# EAGLE design TESTOMATIC-v1_0 (EAGLE 9.7.0)

## Sheet 1 of 3: Power
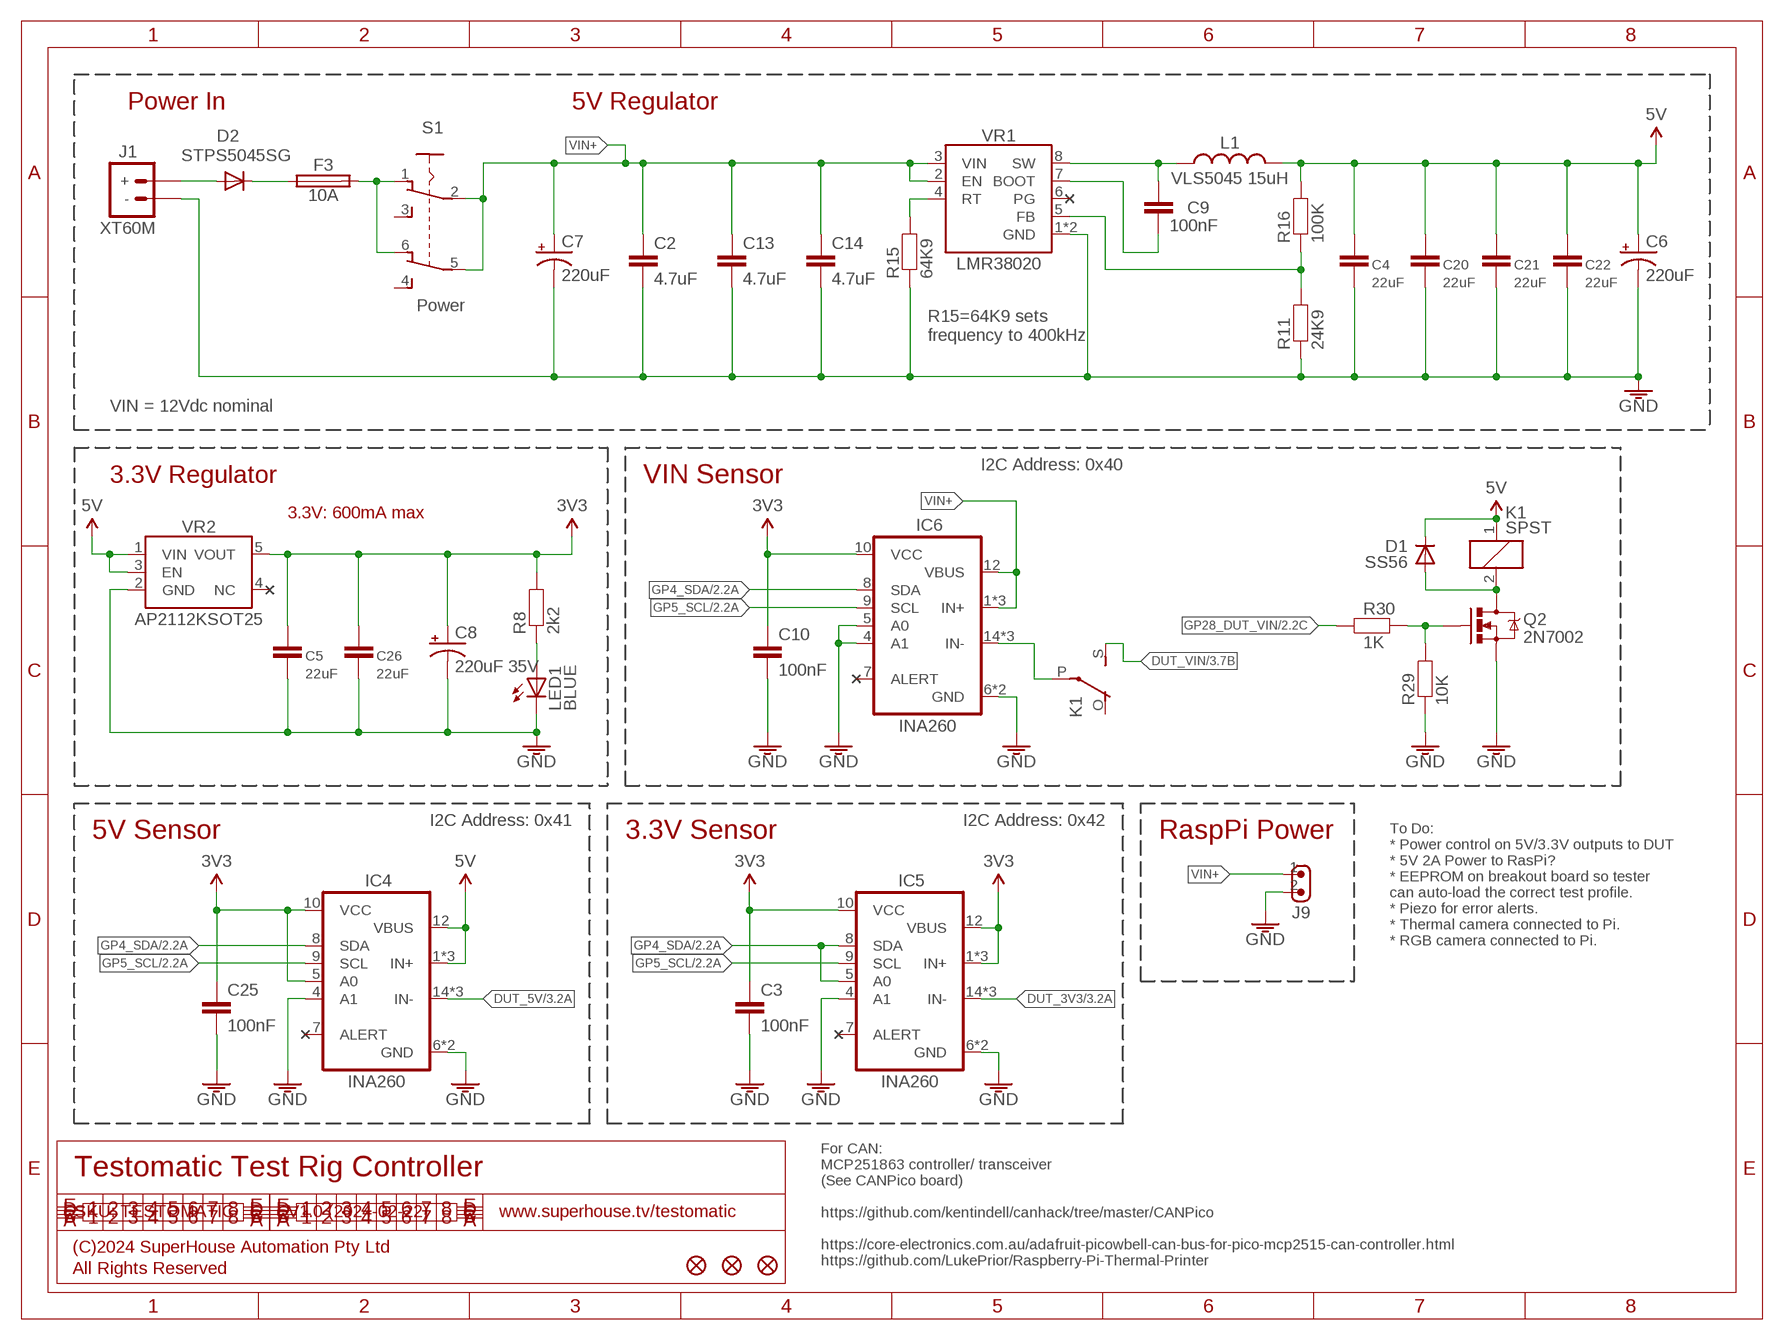
[diagram p0: schematic, sheet 1]

### Parts
C2  4.7uF  CAP1206  [C1206]
C3  100nF  CAP0603  [C0603]
C4  22uF  CAP0805  [C0805]
C5  22uF  CAP0805  [C0805]
C6  220uF  CAP_POLG  [PANASONIC_G]
C7  220uF  CAP_POLG  [PANASONIC_G]
C8  220uF 35V  CAP_POLG  [PANASONIC_G]
C9  100nF  CAP0603  [C0603]
C10  100nF  CAP0603  [C0603]
C13  4.7uF  CAP1206  [C1206]
C14  4.7uF  CAP1206  [C1206]
C20  22uF  CAP0805  [C0805]
C21  22uF  CAP0805  [C0805]
C22  22uF  CAP0805  [C0805]
C25  100nF  CAP0603  [C0603]
C26  22uF  CAP0805  [C0805]
D1  SS56  DIODESMA  [SMA-DIODE]
D2  STPS5045SG  DIODE-D2PAK  [D2PACK]
F3  10A  FUSE-MCCQ  [MCCQ-122]
FID1  FIDUCIAL1X2.5  [FIDUCIAL-1X2.5]
FID2  FIDUCIAL1X2.5  [FIDUCIAL-1X2.5]
FID3  FIDUCIAL1X2.5  [FIDUCIAL-1X2.5]
IC4  INA260  [TSSOP-16]
IC5  INA260  [TSSOP-16]
IC6  INA260  [TSSOP-16]
J1  XT60M  XTXX-60M  [XT60PW-M]
J9  M02-SCREW-3.81MM-VERT  [SCREWTERMINAL-3.81MM-VERT-2]
K1  SPST  [G5LE]
L1  VLS5045 15uH  INDUCTOR-5045  [INDUCTOR-5045]
LED1  BLUE  LED0603  [LED-0603]
Q2  2N7002  MOSFET-NCHANNEL-233  [SOT23-3]
R8  2k2  RESISTOR0603  [R0603]
R11  24K9  RESISTOR0603  [R0603]
R15  64K9  RESISTOR0603  [R0603]
R16  100K  RESISTOR0603  [R0603]
R29  10K  RESISTOR0603  [R0603]
R30  1K  RESISTOR0603  [R0603]
S1  Power  SWITCH-DPDT3  [7201SD9AV2BE]
VR1  LMR38020  LMR38010  [HSOIC8]
VR2  AP2112KSOT25  [SOT23-5]

### Nets
3.3V: C3.1 C5.1 C8.+ C10.1 C25.1 C26.1 IC4.5(A0) IC4.10(VCC) IC5.1(IN+) IC5.2(IN+) IC5.3(IN+) IC5.10(VCC) IC5.12(VBUS) IC6.10(VCC) R8.2 VR2.5(VOUT) ; also sheet 2,3
5V: C4.1 C6.+ C20.1 C21.1 C22.1 D1.C IC4.1(IN+) IC4.2(IN+) IC4.3(IN+) IC4.12(VBUS) K1.1 L1.2 R16.2 VR2.1(VIN) VR2.3(EN) ; also sheet 3
DUT_3V3: IC5.14(IN-) IC5.15(IN-) IC5.16(IN-) ; also sheet 3
DUT_5V: IC4.14(IN-) IC4.15(IN-) IC4.16(IN-) ; also sheet 3
DUT_VIN: K1.S(2:NO) ; also sheet 3
GND: C2.2 C3.2 C4.2 C5.2 C6.- C7.- C8.- C10.2 C13.2 C14.2 C20.2 C21.2 C22.2 C25.2 C26.2 IC4.4(A1) IC4.6(GND) IC4.11(GND) IC5.4(A1) IC5.6(GND) IC5.11(GND) IC6.4(A1) IC6.5(A0) IC6.6(GND) IC6.11(GND) J1.- J9.2 LED1.C Q2.2(S) R11.1 R15.1 R29.1 VR1.1(GND) VR1.TGND(GND) VR2.2(GND) ; also sheet 2,3
GP4_SDA: IC4.8(SDA) IC5.5(A0) IC5.8(SDA) IC6.8(SDA) ; also sheet 2,3
GP5_SCL: IC4.9(SCL) IC5.9(SCL) IC6.9(SCL) ; also sheet 2,3
GP28_DUT_VIN: R30.1 ; also sheet 2
N$3: C9.1 L1.1 VR1.8(SW)
N$8: D2.2(C) F3.1 F3.2
N$13: R15.2 VR1.4(RT)
N$16: IC6.14(IN-) IC6.15(IN-) IC6.16(IN-) K1.P(2:COM)
N$17: D1.A K1.2 Q2.3(D)
N$18: R11.2 R16.1 VR1.5(FB)
N$19: C9.2 VR1.7(BOOT)
N$23: LED1.A R8.1
N$24: Q2.1(G) R29.2 R30.2
N$25: F3.3 F3.4 S1.1 S1.6
N$26: D2.1(A) D2.3(A) J1.+
VIN+: C2.1 C7.+ C13.1 C14.1 IC6.1(IN+) IC6.2(IN+) IC6.3(IN+) IC6.12(VBUS) J9.1 S1.2 S1.5 VR1.2(EN) VR1.3(VIN)
Unconnected: IC4.7(ALERT) IC5.7(ALERT) IC6.7(ALERT) K1.O(2:NC) S1.3 S1.4 VR2.4(NC)

### Notes on the sheet
- Power In | 5V Regulator
- R15=64K9 sets
  frequency to 400kHz
- VIN = 12Vdc nominal
- I2C Address: 0x40
- 3.3V Regulator | VIN Sensor
- 3.3V: 600mA max
- I2C Address: 0x41 | I2C Address: 0x42
- 5V Sensor | 3.3V Sensor | RaspPi Power
- To Do:
  * Power control on 5V/3.3V outputs to DUT
  * 5V 2A Power to RasPi?
  * EEPROM on breakout board so tester
  can auto-load the correct test profile.
  * Piezo for error alerts.
  * Thermal camera connected to Pi.
  * RGB camera connected to Pi.
- Testomatic Test Rig Controller
- SKU: TESTOMATIC | V1.0 (2024-02-22) | www.superhouse.tv/testomatic
- (C)2024 SuperHouse Automation Pty Ltd
- For CAN:
  MCP251863 controller/ transceiver
  (See CANPico board)
  
  https://github.com/kentindell/canhack/tree/master/CANPico
  
  https://core-electronics.com.au/adafruit-picowbell-can-bus-for-pico-mcp2515-can-controller.html
  https://github.com/LukePrior/Raspberry-Pi-Thermal-Printer
- All Rights Reserved

## Sheet 2 of 3: Microcontroller
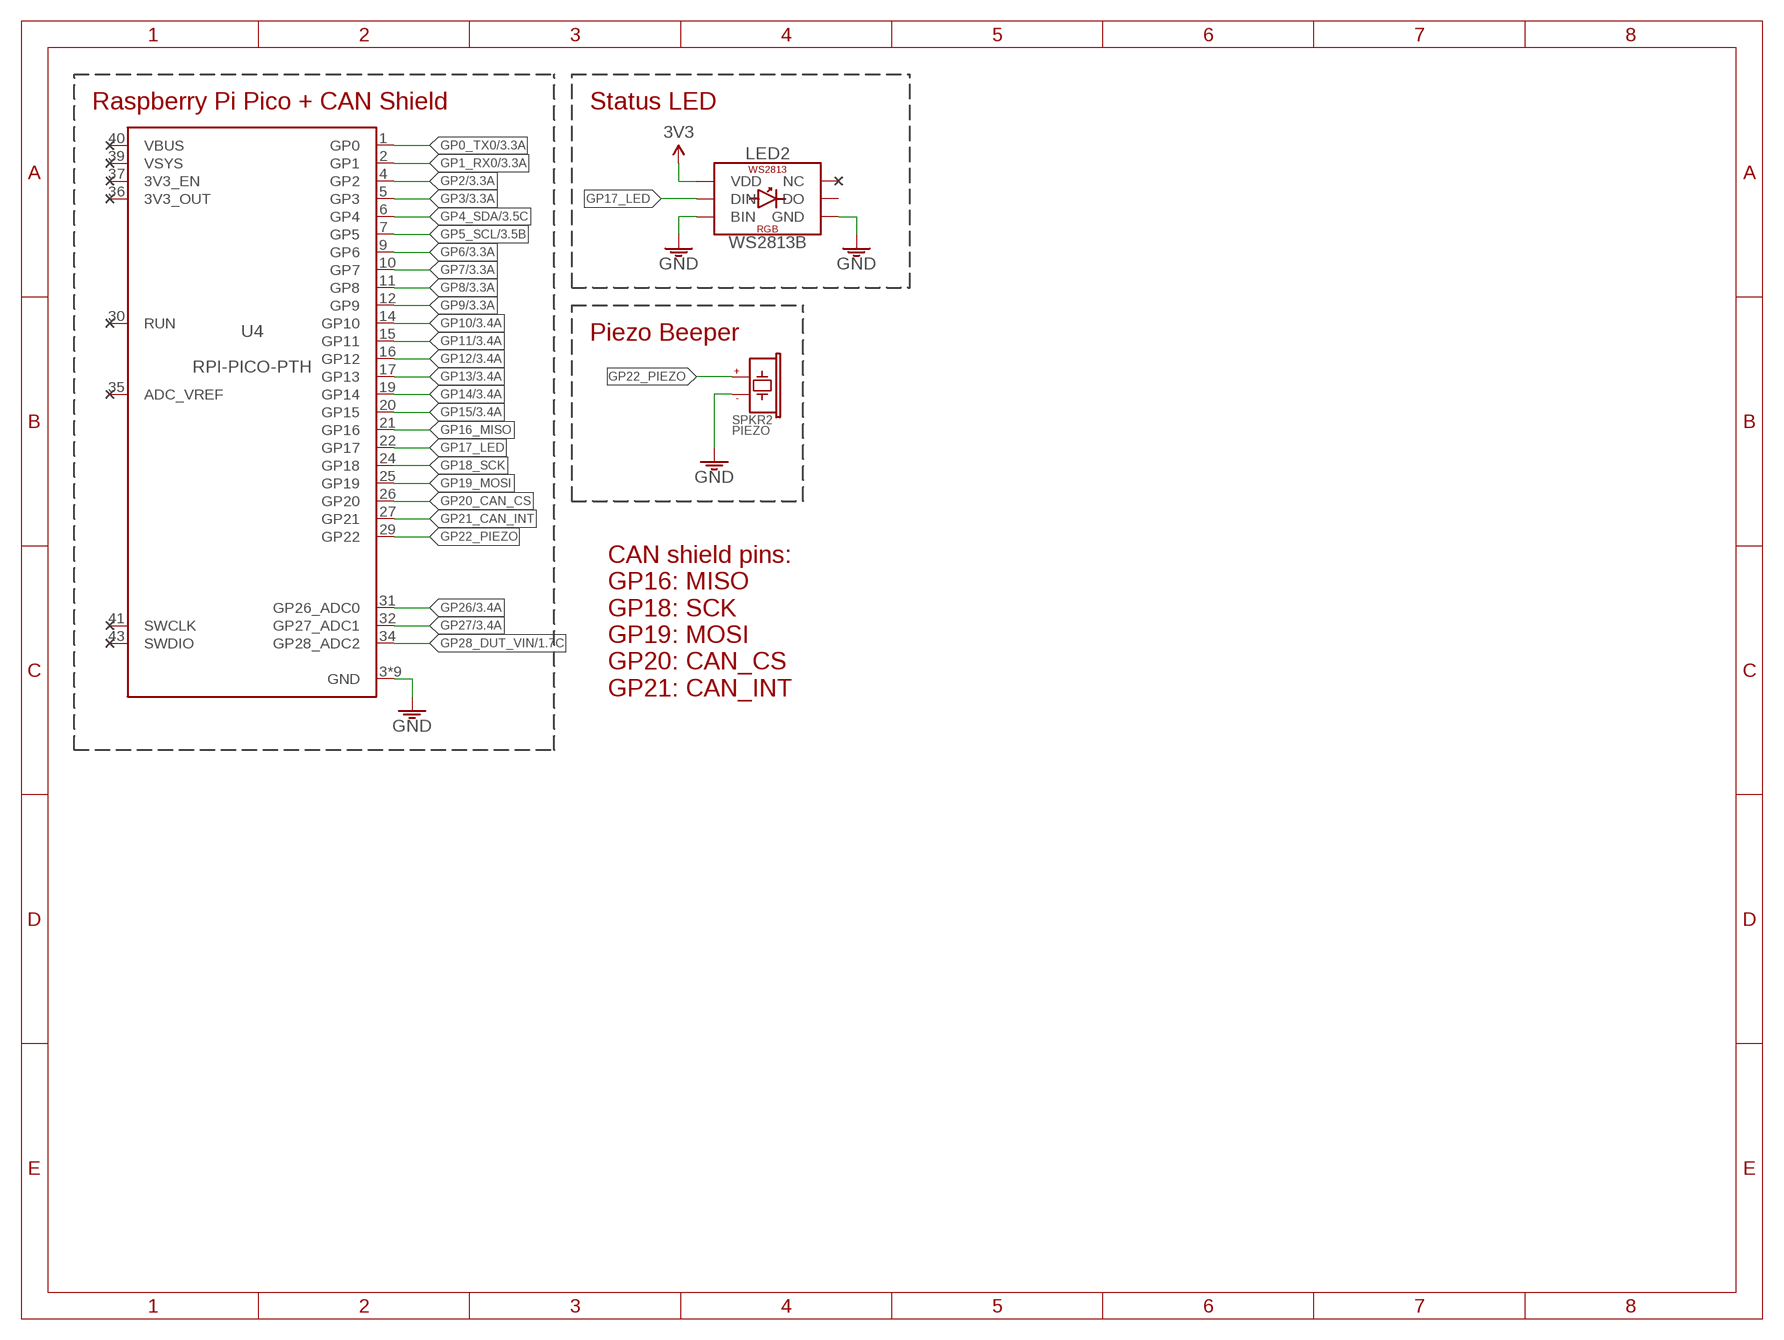
[diagram p1: schematic, sheet 2]

### Parts
LED2  WS2813B  WS2813-5050  [WS2813]
SPKR2  PIEZO  PIEZOPOLARISED-SMT  [PIEZO-9.6X9.6-SMT]
U4  RPI-PICO-PTH  [PICO-PTH]

### Nets
3.3V: LED2.2(VDD) ; also sheet 1,3
GND: LED2.5(GND) LED2.6(BIN) SPKR2.2(-) U4.3(GND) U4.8(GND) U4.13(GND) U4.18(GND) U4.23(GND) U4.28(GND) U4.33(GND) U4.38(GND) U4.42(GND) ; also sheet 1,3
GP0_TX0: U4.1(GP0) ; also sheet 3
GP1_RX0: U4.2(GP1) ; also sheet 3
GP2: U4.4(GP2) ; also sheet 3
GP3: U4.5(GP3) ; also sheet 3
GP4_SDA: U4.6(GP4) ; also sheet 1,3
GP5_SCL: U4.7(GP5) ; also sheet 1,3
GP6: U4.9(GP6) ; also sheet 3
GP7: U4.10(GP7) ; also sheet 3
GP8: U4.11(GP8) ; also sheet 3
GP9: U4.12(GP9) ; also sheet 3
GP10: U4.14(GP10) ; also sheet 3
GP11: U4.15(GP11) ; also sheet 3
GP12: U4.16(GP12) ; also sheet 3
GP13: U4.17(GP13) ; also sheet 3
GP14: U4.19(GP14) ; also sheet 3
GP15: U4.20(GP15) ; also sheet 3
GP16_MISO: U4.21(GP16)
GP17_LED: LED2.4(DIN) U4.22(GP17)
GP18_SCK: U4.24(GP18)
GP19_MOSI: U4.25(GP19)
GP20_CAN_CS: U4.26(GP20)
GP21_CAN_INT: U4.27(GP21)
GP22_PIEZO: SPKR2.1(+) U4.29(GP22)
GP26: U4.31(GP26_ADC0) ; also sheet 3
GP27: U4.32(GP27_ADC1) ; also sheet 3
GP28_DUT_VIN: U4.34(GP28_ADC2) ; also sheet 1
Unconnected: LED2.1(NC) LED2.3(DO) U4.30(RUN) U4.35(ADC_VREF) U4.36(3V3_OUT) U4.37(3V3_EN) U4.39(VSYS) U4.41(SWCLK) U4.43(SWDIO)

### Notes on the sheet
- Raspberry Pi Pico + CAN Shield | Status LED
- Piezo Beeper
- CAN shield pins:
  GP16: MISO
  GP18: SCK
  GP19: MOSI
  GP20: CAN_CS
  GP21: CAN_INT

## Sheet 3 of 3: Headers
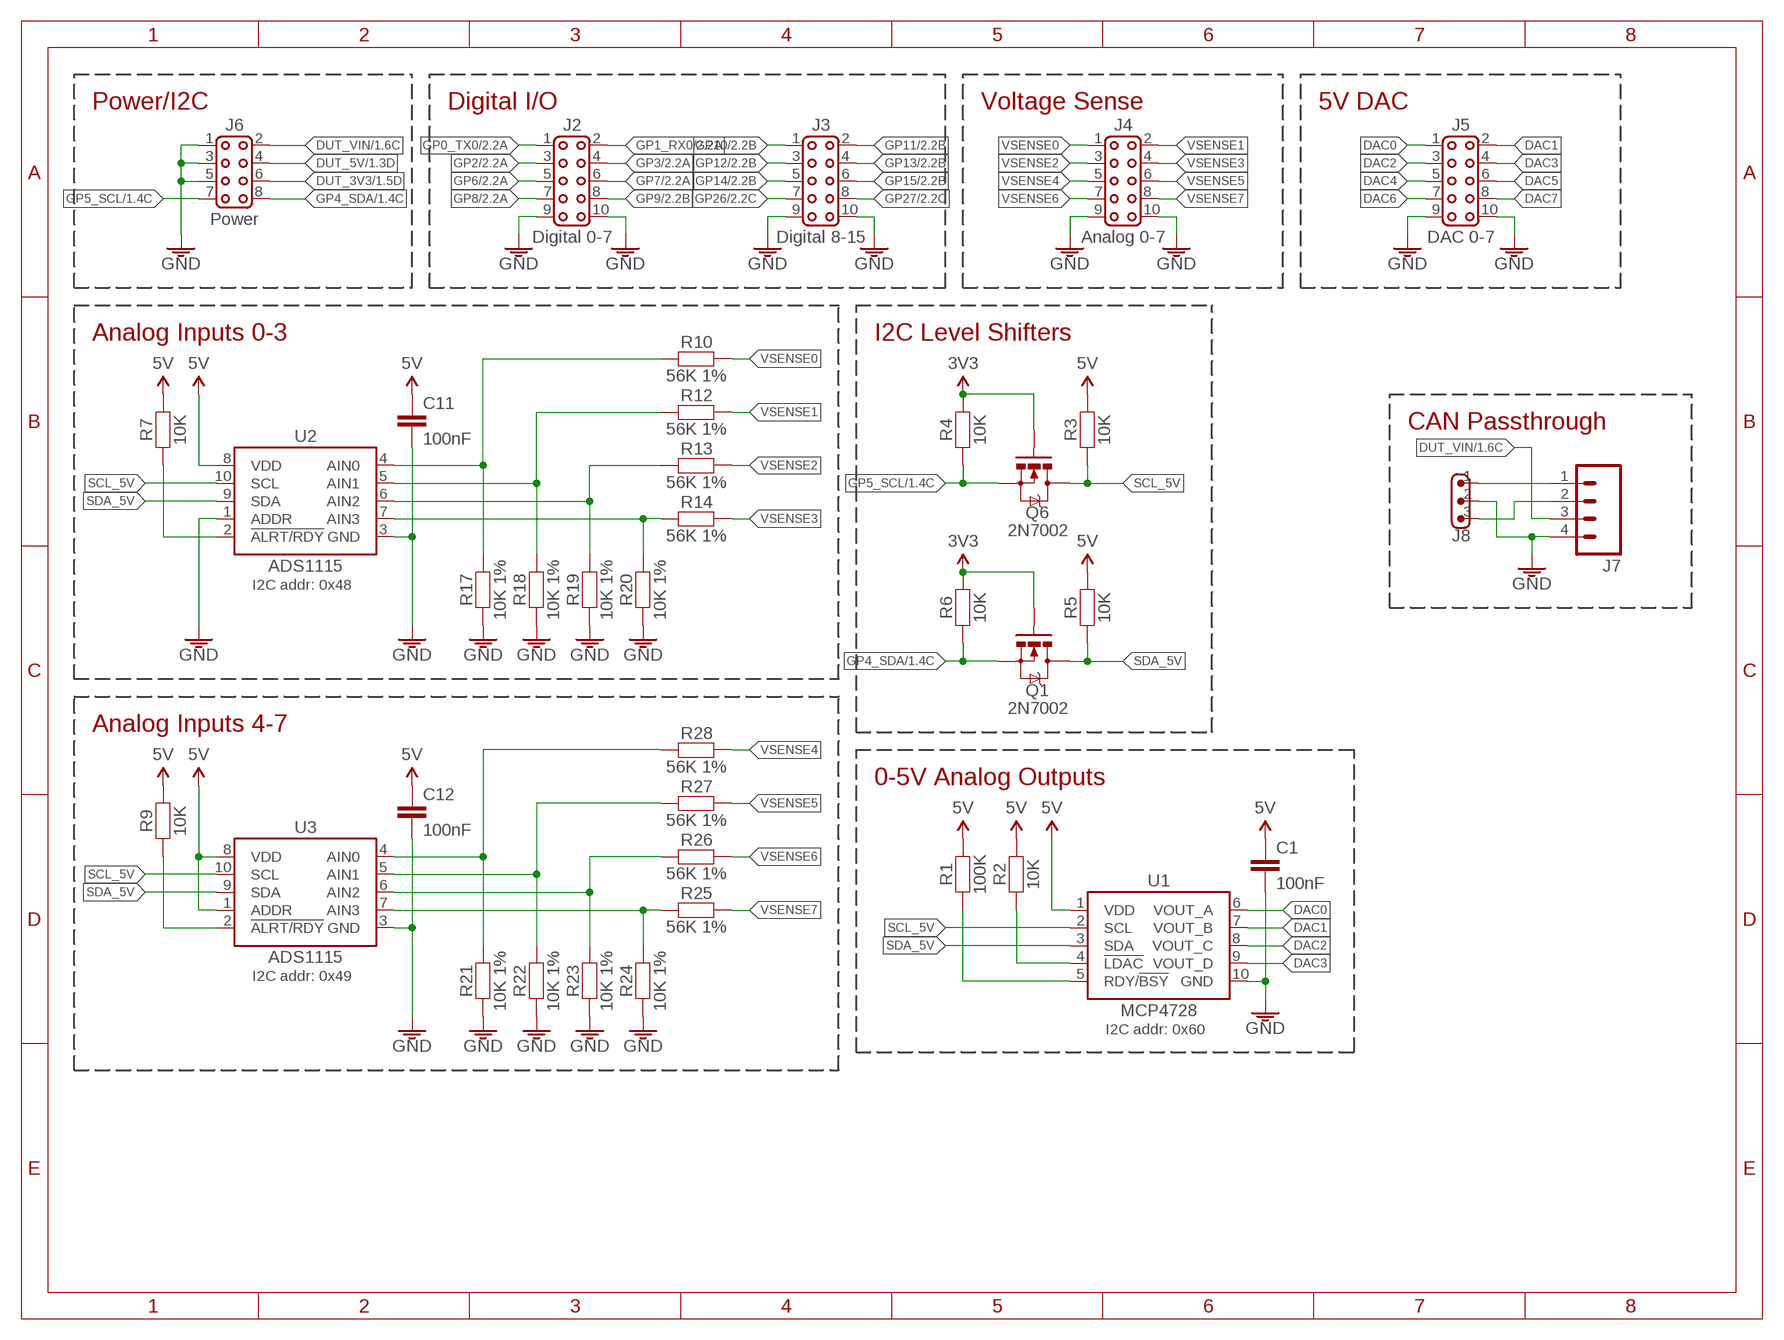
[diagram p2: schematic, sheet 3]

### Parts
C1  100nF  CAP0603  [C0603]
C11  100nF  CAP0603  [C0603]
C12  100nF  CAP0603  [C0603]
J2  Digital 0-7  M02X5-SHROUDED  [2X05-2.54-SHROUDED]
J3  Digital 8-15  M02X5-SHROUDED  [2X05-2.54-SHROUDED]
J4  Analog 0-7  M02X5-SHROUDED  [2X05-2.54-SHROUDED]
J5  DAC 0-7  M02X5-SHROUDED  [2X05-2.54-SHROUDED]
J6  Power  M02X4-SHROUD  [2X04-2.54-SHROUDED]
J7  M04-SCREW-3.81MM-VERT-PLUG  [SCREWTERMINAL-3.81MM-VERT-4]
J8  M03-SCREW-3.5MM  [SCREWTERMINAL-3.5MM-3]
Q1  2N7002  MOSFET-NCHANNEL-233  [SOT23-3]
Q6  2N7002  MOSFET-NCHANNEL-233  [SOT23-3]
R1  100K  RESISTOR0603  [R0603]
R2  10K  RESISTOR0603  [R0603]
R3  10K  RESISTOR0603  [R0603]
R4  10K  RESISTOR0603  [R0603]
R5  10K  RESISTOR0603  [R0603]
R6  10K  RESISTOR0603  [R0603]
R7  10K  RESISTOR0603  [R0603]
R9  10K  RESISTOR0603  [R0603]
R10  56K 1%  RESISTOR0603  [R0603]
R12  56K 1%  RESISTOR0603  [R0603]
R13  56K 1%  RESISTOR0603  [R0603]
R14  56K 1%  RESISTOR0603  [R0603]
R17  10K 1%  RESISTOR0603  [R0603]
R18  10K 1%  RESISTOR0603  [R0603]
R19  10K 1%  RESISTOR0603  [R0603]
R20  10K 1%  RESISTOR0603  [R0603]
R21  10K 1%  RESISTOR0603  [R0603]
R22  10K 1%  RESISTOR0603  [R0603]
R23  10K 1%  RESISTOR0603  [R0603]
R24  10K 1%  RESISTOR0603  [R0603]
R25  56K 1%  RESISTOR0603  [R0603]
R26  56K 1%  RESISTOR0603  [R0603]
R27  56K 1%  RESISTOR0603  [R0603]
R28  56K 1%  RESISTOR0603  [R0603]
U1  MCP4728  [MSOP10]
U2  ADS1115  [MSOP10]
U3  ADS1115  [MSOP10]

### Nets
3.3V: Q1.1(G) Q6.1(G) R4.2 R6.2 ; also sheet 1,2
5V: C1.1 C11.1 C12.1 R1.2 R2.2 R3.2 R5.2 R7.2 R9.2 U1.1(VDD) U2.8(VDD) U3.1(ADDR) U3.8(VDD) ; also sheet 1
DAC0: J5.1 U1.6(VOUT_A)
DAC1: J5.2 U1.7(VOUT_B)
DAC2: J5.3 U1.8(VOUT_C)
DAC3: J5.4 U1.9(VOUT_D)
DAC4: J5.5
DAC5: J5.6
DAC6: J5.7
DAC7: J5.8
DUT_3V3: J6.6 ; also sheet 1
DUT_5V: J6.4 ; also sheet 1
DUT_VIN: J6.2 J7.3 ; also sheet 1
GND: C1.2 C11.2 C12.2 J2.9 J2.10 J3.9 J3.10 J4.9 J4.10 J5.9 J5.10 J6.1 J6.3 J6.5 J7.4 J8.2 R17.1 R18.1 R19.1 R20.1 R21.1 R22.1 R23.1 R24.1 U1.10(GND) U2.1(ADDR) U2.3(GND) U3.3(GND) ; also sheet 1,2
GP0_TX0: J2.1 ; also sheet 2
GP1_RX0: J2.2 ; also sheet 2
GP2: J2.3 ; also sheet 2
GP3: J2.4 ; also sheet 2
GP4_SDA: J6.8 Q1.2(S) R6.1 ; also sheet 1,2
GP5_SCL: J6.7 Q6.2(S) R4.1 ; also sheet 1,2
GP6: J2.5 ; also sheet 2
GP7: J2.6 ; also sheet 2
GP8: J2.7 ; also sheet 2
GP9: J2.8 ; also sheet 2
GP10: J3.1 ; also sheet 2
GP11: J3.2 ; also sheet 2
GP12: J3.3 ; also sheet 2
GP13: J3.4 ; also sheet 2
GP14: J3.5 ; also sheet 2
GP15: J3.6 ; also sheet 2
GP26: J3.7 ; also sheet 2
GP27: J3.8 ; also sheet 2
N$1: R7.1 U2.2(!ALRT/RDY)
N$2: R10.1 R17.2 U2.4(AIN0)
N$4: R12.1 R18.2 U2.5(AIN1)
N$5: R13.1 R19.2 U2.6(AIN2)
N$6: R14.1 R20.2 U2.7(AIN3)
N$7: R21.2 R28.1 U3.4(AIN0)
N$9: R22.2 R27.1 U3.5(AIN1)
N$10: R23.2 R26.1 U3.6(AIN2)
N$11: R24.2 R25.1 U3.7(AIN3)
N$12: R9.1 U3.2(!ALRT/RDY)
N$14: J7.1 J8.1
N$15: J7.2 J8.3
N$21: R2.1 U1.4(!LDAC)
N$22: R1.1 U1.5(RDY/!BSY)
SCL_5V: Q6.3(D) R3.1 U1.2(SCL) U2.10(SCL) U3.10(SCL)
SDA_5V: Q1.3(D) R5.1 U1.3(SDA) U2.9(SDA) U3.9(SDA)
VSENSE0: J4.1 R10.2
VSENSE1: J4.2 R12.2
VSENSE2: J4.3 R13.2
VSENSE3: J4.4 R14.2
VSENSE4: J4.5 R28.2
VSENSE5: J4.6 R27.2
VSENSE6: J4.7 R26.2
VSENSE7: J4.8 R25.2

### Notes on the sheet
- Power/I2C | Digital I/O | Voltage Sense | 5V DAC
- Analog Inputs 0-3 | I2C Level Shifters
- CAN Passthrough
- I2C addr: 0x48
- Analog Inputs 4-7
- 0-5V Analog Outputs
- I2C addr: 0x49
- I2C addr: 0x60

## Power pins joined to a net without a drawn wire
PG: VR1.6(PG)
VBUS: U4.40(VBUS)

## Library data of the parts
C1-C5 C9-C14 C20-C22 C25 C26 = SuperHouse-Capacitors:CAP: Capacitor Standard ceramic capacitor
C6-C8 = SuperHouse-Capacitors:CAP_POL: Capacitor Polarized These are standard SMD and PTH capacitors. Normally 10uF, 47uF, and 100uF in electrolytic and tantalum varieties. Always verify the external diameter of the through hole cap, it varies with capacity, voltage, and manufacturer. The EIA devices should be standard.
D1 D2 = SuperHouse-Diodes:DIODE: Diode Standard reverse protection diodes and small signal diodes. SMA package can handle up to about 1A. SOD-323 can handle about 200mA.
F3 = SuperHouse-Fuses:FUSE: Fuse
FID1-FID3 = SuperHouse-Symbols:FIDUCIAL: Fiducial Alignment Points Various fiducial points for machine vision alignment.
IC4-IC6 = SuperHouse-Sensors:INA260: INA260 current / voltage sensor
J1 = SuperHouse-Connectors:XTXX: XT30/60/90 connector
J2-J5 = SuperHouse-Connectors:M02X5: M10 header in 2x5 format
J6 = SuperHouse-Connectors:M02X4: M08 header in 2x4 format
J7 = SuperHouse-Connectors:M04: 4-way header Standard 1x4 header, and screw terminal variations
J8 = SuperHouse-Connectors:M03: 3-way header Standard 1x3 header, and screw terminal variations
J9 = SuperHouse-Connectors:M02: 2-way header Standard 1x2 header, and screw terminal variations
K1 = SuperHouse-Relays:SPST: SPST relay in various packages: Omron G5LE; OC_FARNELL: unknown; OC_NEWARK: unknown
L1 = SuperHouse-Inductors:INDUCTOR: INDUCTOR, American symbol
LED1 = SuperHouse-LEDs:LED: LEDs in various sizes including 5mm and 3mm PTH, and 0402, 0603, 0805, etc SMT
LED2 = SuperHouse-LEDs:WS2813
Q1 Q2 Q6 = SuperHouse-Transistors:MOSFET-NCHANNEL: N-channel MOSFET
R1-R30 = SuperHouse-Resistors:RESISTOR: Resistors in both surface-mount and through-hole versions.
S1 = SuperHouse-Switches:SWITCH-DPDT: DPDT toggle switch
SPKR2 = SuperHouse-Audio:PIEZOPOLARISED
U1 = SuperHouse-ICs:MCP4728
U2 U3 = SuperHouse-ICs:ADS1115
U4 = SuperHouse-MCUs:RPI-PICO
VR1 = SuperHouse-Regulators:LMR38010
VR2 = SuperHouse-Regulators:AP2112K: AP2112K LDO linear voltage regulator

## Net classes
0 Default: width 0.203 mm
1 VCC: width 0.305 mm

## Board
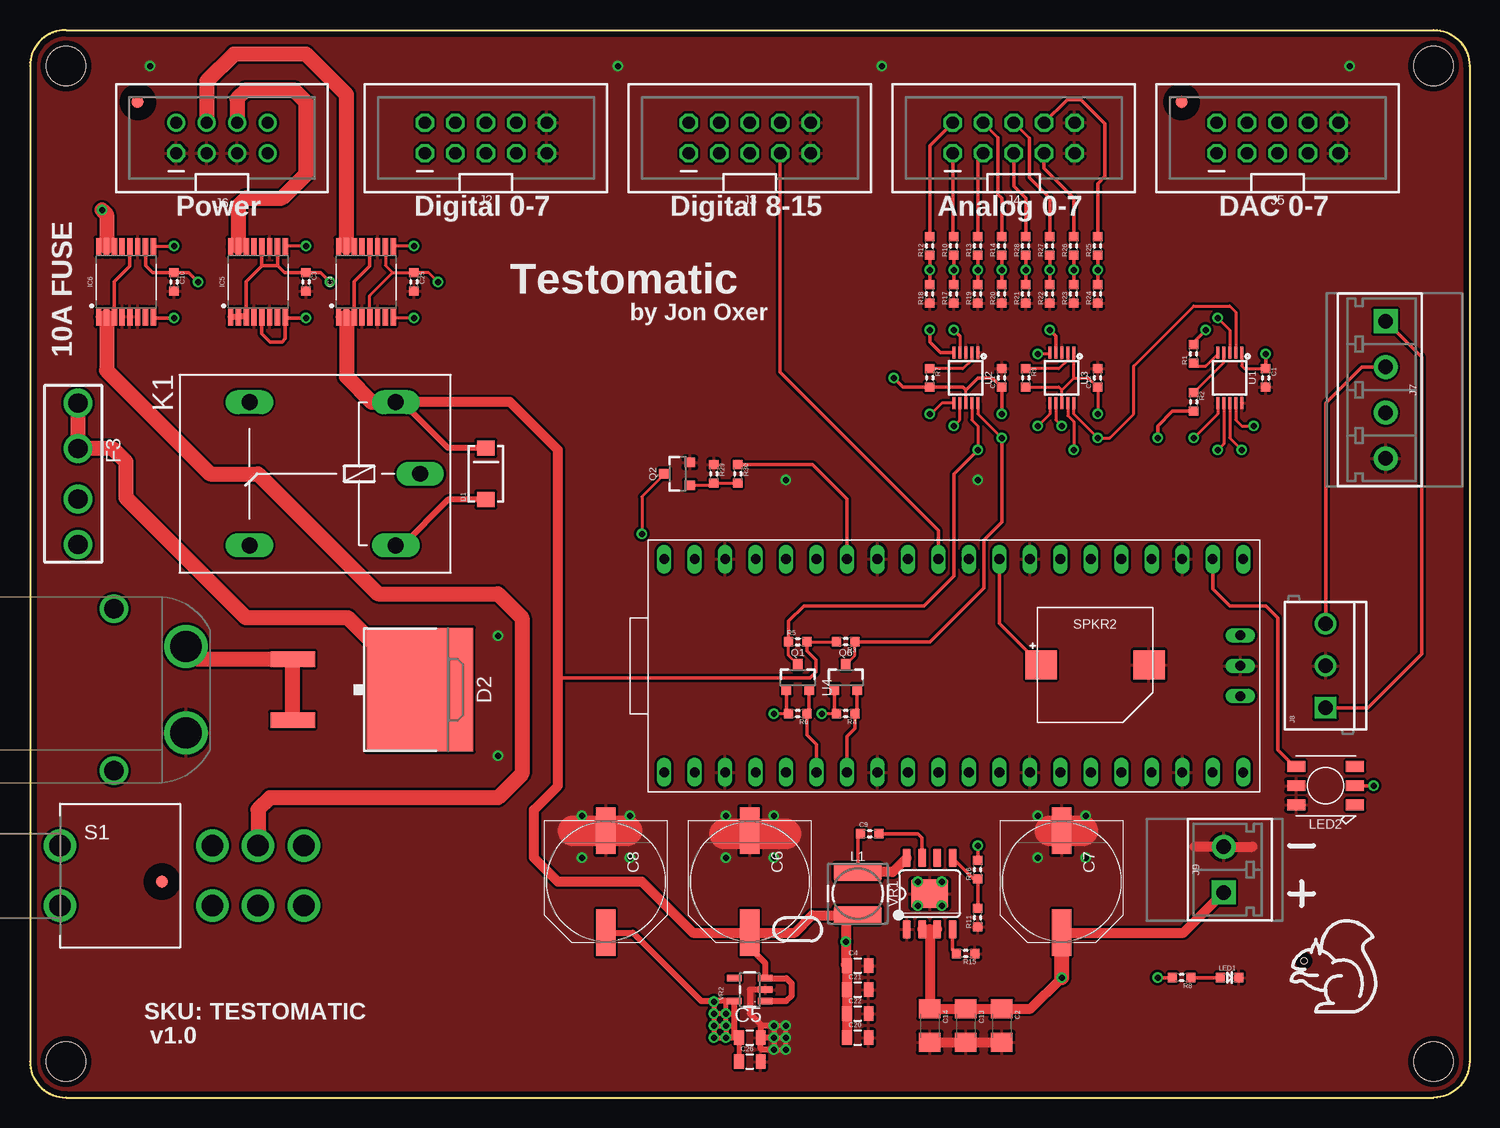
[diagram p3: board, top side]
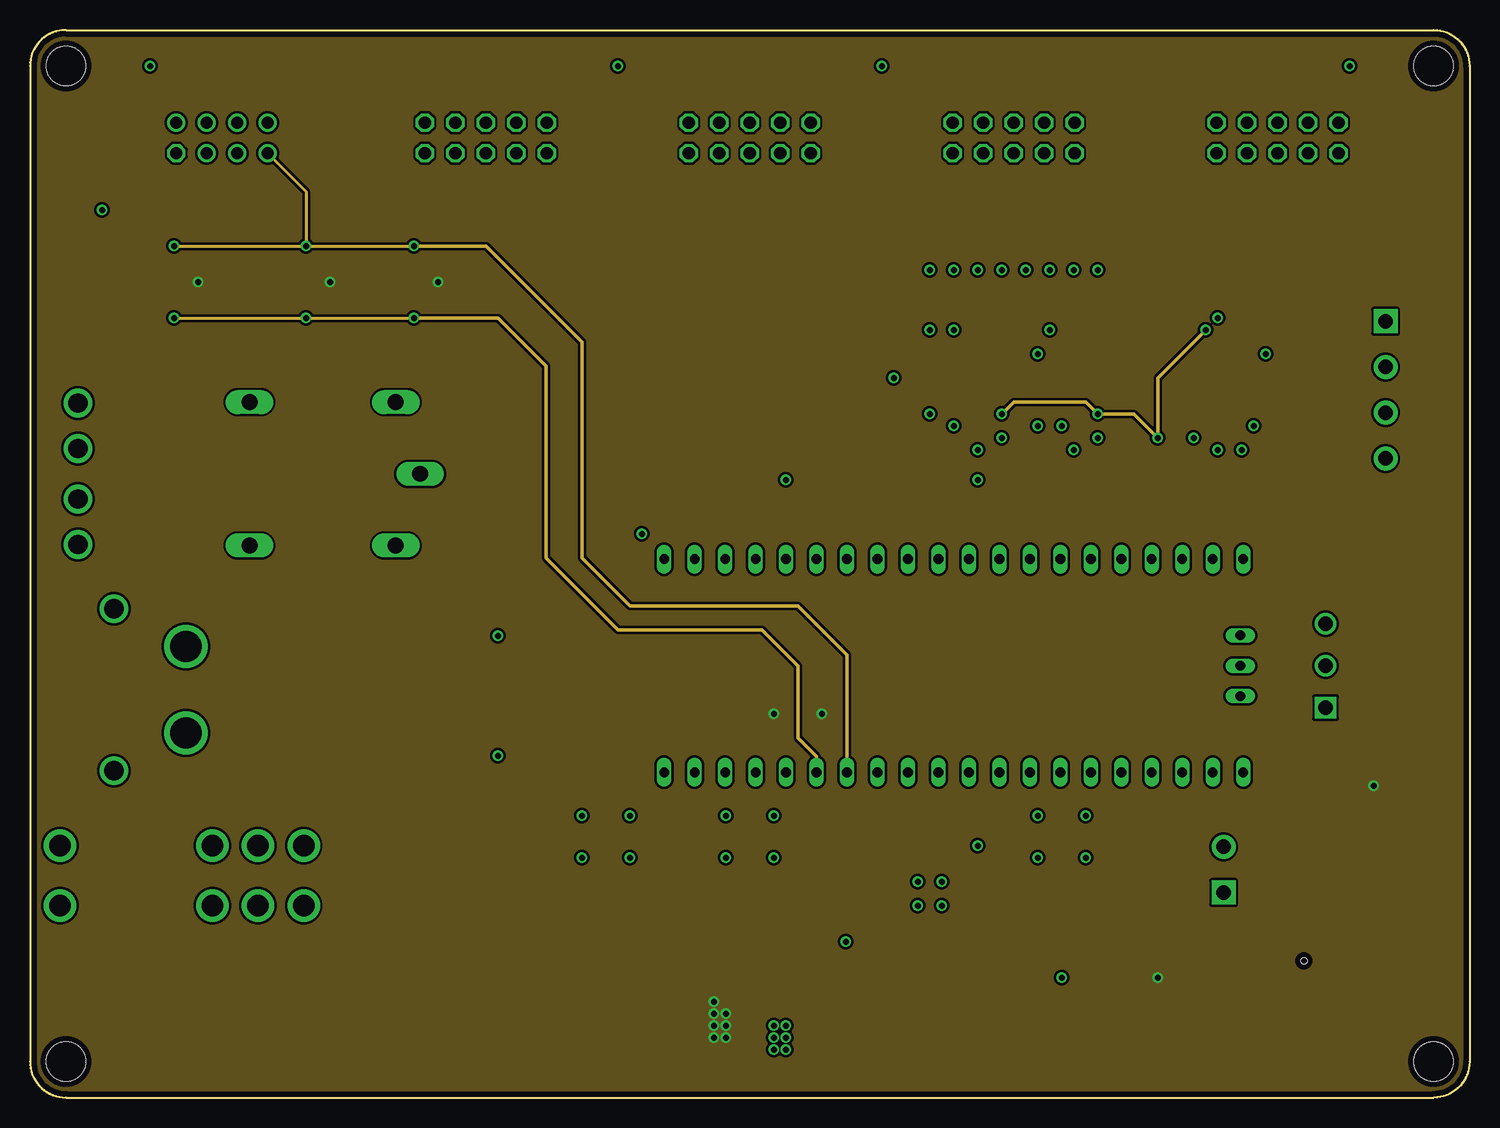
[diagram p4: board, inner layer Route2]
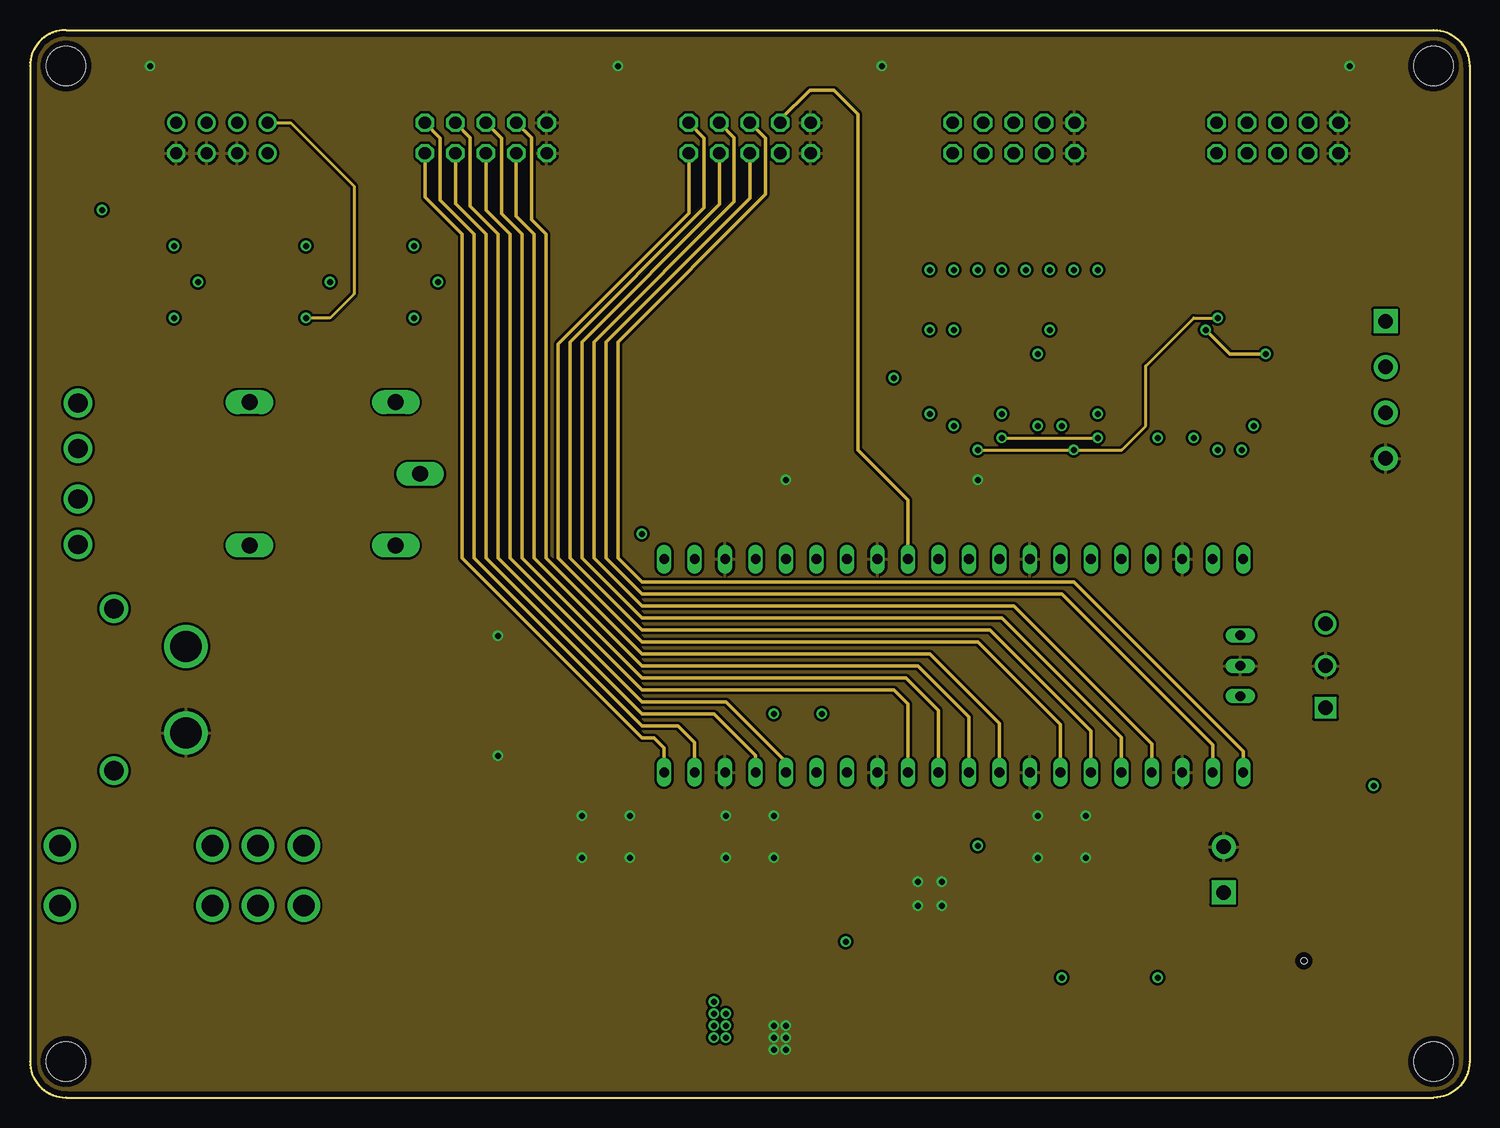
[diagram p5: board, inner layer Route15]
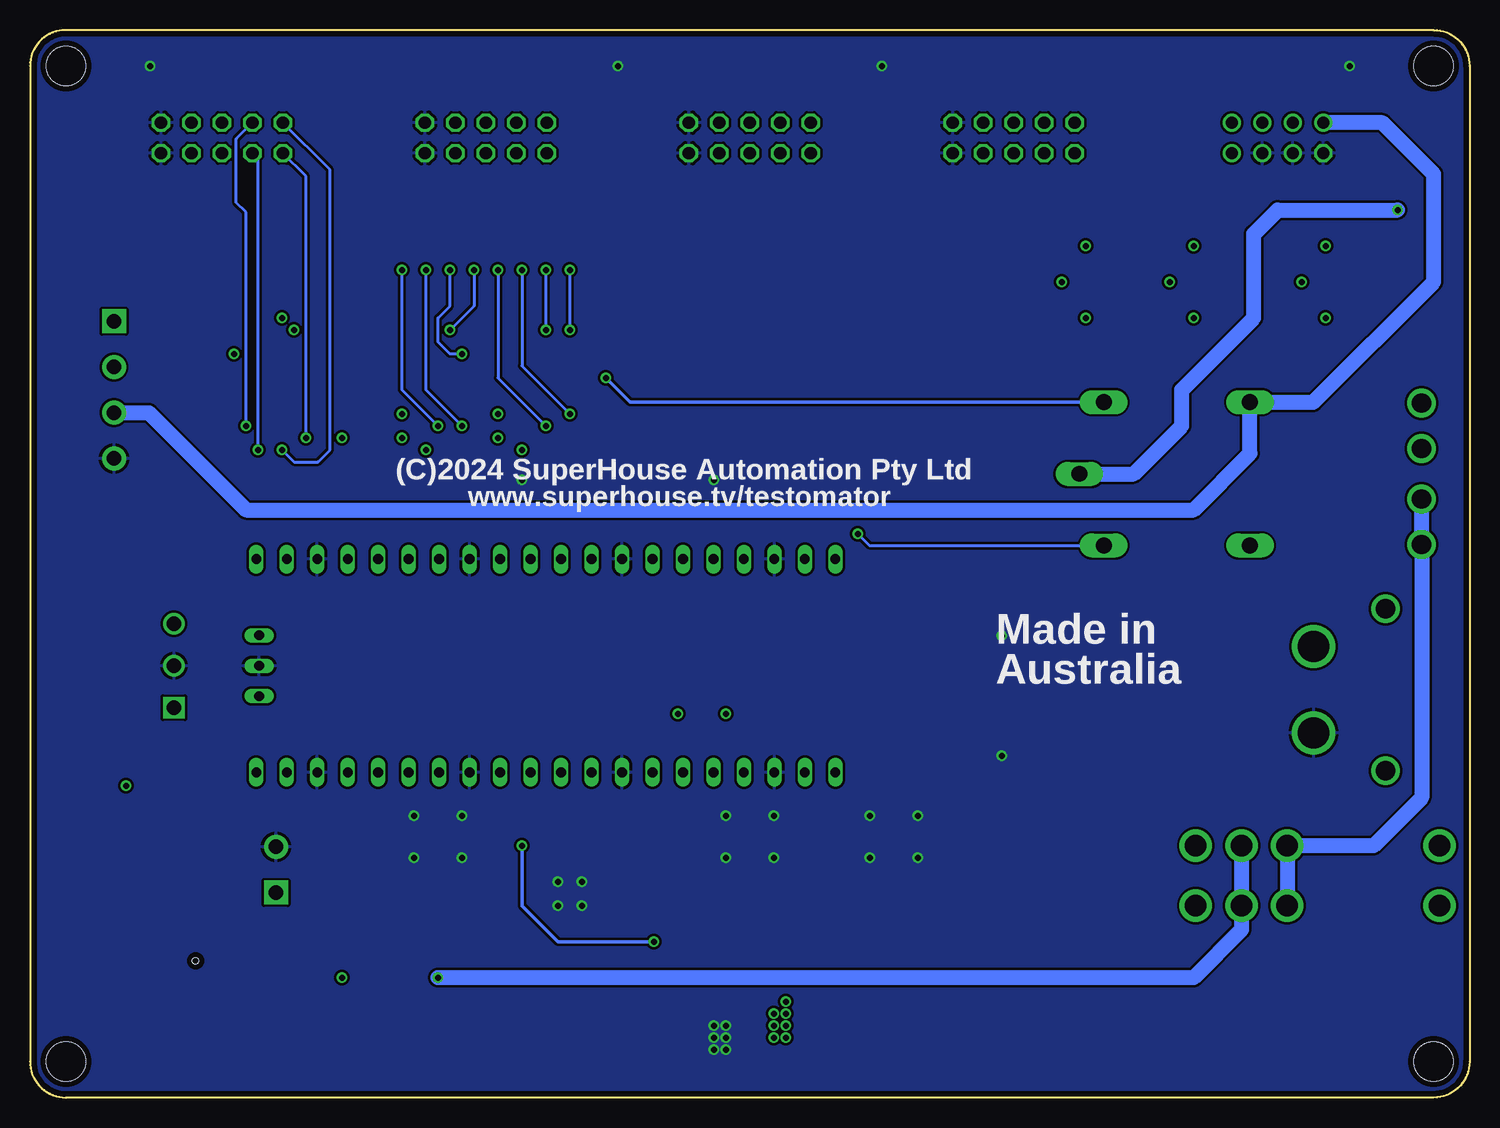
[diagram p6: board, bottom side, seen from below]

Size 120 x 89 mm. Coordinates in mm from the lower left corner, seen from the top.
Outline: 3,89 117,89 arc-90 120,86 120,3 arc-90 117,0 3,0 arc-90 0,3 0,86 arc-90 3,89
Copper layers (1+2*15+16): Top 0.035mm / dielectric 1.5mm / Route2 0.035mm / dielectric 0.15mm / Route15 0.035mm / dielectric 0.2mm / Bottom 0.035mm
Design rules "SuperHouse-Design-Rules *": minimum track width 10mil, minimum drill 24mil, track to track 8mil, track to pad 8mil, pad to pad 8mil, via to via 8mil, smd to smd 6mil, copper to edge 18mil, drill to drill 8mil, minimum pad ring 7mil, minimum via ring 8mil, stop-mask expansion 4mil, vias tented up to drill 0.5mm, thermal gap 10mil
Holes 0.5 mm at 106.2,11.4
Holes 3.3 mm at 3,3 3,86 117,86 117,3
tRestrict: area 95,82 to 97,84; area 10,17 to 12,19; area 8,82 to 10,84

### Footprints (pad centres in the part's own frame; a part is rotated, then mirrored left to right if it is on the bottom)
C0603 = smd 0.762 x 0.762: 1 -0.762,0; 2 0.762,0
C1206 = smd 1.6 x 1.8: 1 -1.4,0; 2 1.4,0
C0805 = smd 0.8 x 1.2: 1 -0.9,0; 2 0.9,0
PANASONIC_G = smd 3.9 x 1.6: + 4.25,0; - -4.25,0
SMA-DIODE = smd 1.27 x 1.47: A -2.15,0; C 2.15,0
D2PACK = smd 1.3 x 3.7: 1 -2.54,-8.1; 3 2.54,-8.1 | smd 10.3 x 8.9: 2 0,2.5
MCCQ-122 = drill 1.6: 1 -5.9,0; 2 -2.1,0; 3 2.1,0; 4 5.9,0
FIDUCIAL-1X2.5 = smd 1 x 1: 1 0,0
TSSOP-16 = smd 1.5 x 0.45: 1 -2.9,2.275; 2 -2.9,1.625; 3 -2.9,0.975; 4 -2.9,0.325; 5 -2.9,-0.325; 6 -2.9,-0.975; 7 -2.9,-1.625; 8 -2.9,-2.275; 9 2.9,-2.275; 10 2.9,-1.625; 11 2.9,-0.975; 12 2.9,-0.325; 13 2.9,0.325; 14 2.9,0.975; 15 2.9,1.625; 16 2.9,2.275
XT60PW-M = drill 2.6: + -3.6,6; - 3.6,6 | drill 1.6: P$1 -6.75,0; P$2 6.75,0
2X05-2.54-SHROUDED = drill 1.016 octagon: 1 -5.08,-1.27; 2 -5.08,1.27; 3 -2.54,-1.27; 4 -2.54,1.27; 5 0,-1.27; 6 0,1.27; 7 2.54,-1.27; 8 2.54,1.27; 9 5.08,-1.27; 10 5.08,1.27
2X04-2.54-SHROUDED = drill 1 octagon: 1 -3.81,-1.27 | drill 1: 2 -3.81,1.27; 3 -1.27,-1.27; 4 -1.27,1.27; 5 1.27,-1.27; 6 1.27,1.27; 7 3.81,-1.27; 8 3.81,1.27
SCREWTERMINAL-3.81MM-VERT-4 = drill 1.2 pad 2 square: 1 -5.715,0 | drill 1.2 pad 2: 2 -1.902,0; 3 1.908,0; 4 5.718,0
SCREWTERMINAL-3.5MM-3 = drill 1.2 square: 1 -3.5,0 | drill 1.2: 2 0,0; 3 3.5,0
SCREWTERMINAL-3.81MM-VERT-2 = drill 1.2 pad 2 square: 1 -1.905,0 | drill 1.2 pad 2: 2 1.908,0
G5LE = drill 1.321 long: 1 -7.493,-5.969; 2 -7.493,5.969; O 4.699,5.969; P -9.525,0; S 4.699,-5.969
INDUCTOR-5045 = smd 4 x 1.5: 1 0,1.8; 2 0,-1.8
LED-0603 = smd 0.762 x 0.762: A -0.762,0; C 0.762,0
WS2813 = smd 1.5 x 0.9: 1 -2.45,1.6; 2 -2.45,0; 3 -2.45,-1.6; 4 2.45,-1.6; 5 2.45,0; 6 2.45,1.6
SOT23-3 = smd 0.8 x 0.9: 1 -0.95,-1; 2 0.95,-1; 3 0,1.1
R0603 = smd 0.762 x 0.762: 1 -0.762,0; 2 0.762,0
7201SD9AV2BE = drill 1.8: 1 12.7,-2.5; 2 16.51,-2.5; 3 20.32,-2.5; 4 20.32,2.5; 5 16.51,2.5; 6 12.7,2.5; 7 0,2.5; 8 0,-2.5
PIEZO-9.6X9.6-SMT = smd 2.6 x 2.4: 1 -4.5,0; 2 4.5,0
MSOP10 = smd 1 x 0.25: 1 -2.113,1; 2 -2.113,0.5; 3 -2.113,0; 4 -2.113,-0.5; 5 -2.113,-1; 6 2.113,-1; 7 2.113,-0.5; 8 2.113,0; 9 2.113,0.5; 10 2.113,1
PICO-PTH = drill 0.813 long: 1 -8.89,24.13; 2 -8.89,21.59; 3 -8.89,19.05; 4 -8.89,16.51; 5 -8.89,13.97; 6 -8.89,11.43; 7 -8.89,8.89; 8 -8.89,6.35; 9 -8.89,3.81; 10 -8.89,1.27; 11 -8.89,-1.27; 12 -8.89,-3.81; 13 -8.89,-6.35; 14 -8.89,-8.89; 15 -8.89,-11.43; 16 -8.89,-13.97; 17 -8.89,-16.51; 18 -8.89,-19.05; 19 -8.89,-21.59; 20 -8.89,-24.13; 21 8.89,-24.13; 22 8.89,-21.59; 23 8.89,-19.05; 24 8.89,-16.51; 25 8.89,-13.97; 26 8.89,-11.43; 27 8.89,-8.89; 28 8.89,-6.35; 29 8.89,-3.81; 30 8.89,-1.27; 31 8.89,1.27; 32 8.89,3.81; 33 8.89,6.35; 34 8.89,8.89; 35 8.89,11.43; 36 8.89,13.97; 37 8.89,16.51; 38 8.89,19.05; 39 8.89,21.59; 40 8.89,24.13; 41 -2.54,-23.9; 42 0,-23.9; 43 2.54,-23.9
HSOIC8 = smd 1.524 x 0.66: 1 -2.973,1.905; 2 -2.973,0.635; 3 -2.973,-0.635; 4 -2.973,-1.905; 5 2.973,-1.905; 6 2.973,-0.635; 7 2.973,0.635; 8 2.973,1.905 | smd 2.4 x 3.1: TGND 0,0
SOT23-5 = smd 0.55 x 1.2: 1 -0.95,-1.3; 2 0,-1.3; 3 0.95,-1.3; 4 0.95,1.3; 5 -0.95,1.3

### Placement (x,y rotation side)
C1  103,60 270 top
C2  81,6 270 top
C3  23,68 270 top
C4  69,11 0 top
C5  60,5 0 top
C6  60,18 270 top
C7  86,18 270 top
C8  48,18 270 top
C9  70,22 0 top
C10  12,68 270 top
C11  81,60 90 top
C12  89,60 90 top
C13  78,6 270 top
C14  75,6 270 top
C20  69,5 0 top
C21  69,9 0 top
C22  69,7 0 top
C25  32,68 270 top
C26  60,3 0 top
D1  38,52 90 top
D2  30,34 270 top
F3  4,52 270 top
FID1  96,83 180 top
FID2  11,18 180 top
FID3  8.98,83 90 top
IC4  28,68 90 top
IC5  19,68 90 top
IC6  8,68 90 top
J1  7,34 270 top
J2  38,80 0 top
J3  60,80 0 top
J4  82,80 0 top
J5  104,80 0 top
J6  16,80 0 top
J7  113,59 270 top
J8  108,36 90 top
J9  99.5,19 90 top
K1  23,52 180 top
L1  69,17 0 top
LED1  100,10 0 top
LED2  108,26 180 top
Q1  64,35 0 top
Q2  54,52 90 top
Q6  68,35 0 top
R1  97,62 90 top
R2  97,58 270 top
R3  68,38 180 top
R4  68,32 180 top
R5  64,38 0 top
R6  64,32 180 top
R7  75,60 270 top
R8  96,10 180 top
R9  83,60 270 top
R10  77,71 90 top
R11  79,15 90 top
R12  75,71 90 top
R13  79,71 90 top
R14  81,71 90 top
R15  78,12 180 top
R16  79,19 90 top
R17  77,67 90 top
R18  75,67 90 top
R19  79,67 90 top
R20  81,67 90 top
R21  83,67 90 top
R22  85,67 90 top
R23  87,67 90 top
R24  89,67 90 top
R25  89,71 90 top
R26  87,71 90 top
R27  85,71 90 top
R28  83,71 90 top
R29  57,52 270 top
R30  59,52 270 top
S1  2.5,18.5 0 top
SPKR2  88.78,36.06 0 top
U1  100,60 270 top
U2  78,60 270 top
U3  86,60 270 top
U4  77,36 90 top
VR1  75,17 90 top
VR2  60,9 90 top

### Tracks (layer width: path | path; a pad name or v marks a point on that pad's centre or on a via)
3.3V  (via drill 0.5)
  Top 0.254: 67.05,32.19 R4.2 v66,32 | 63.05,32.19 R6.2 v62,32 | IC4.10 29.62,69.38 30.24,68.76 | 30.24,68.76 C25.1 33.24,68.76 v34,68 | IC4.5 28.32,66.85 30.24,68.76
  Top 0.305: v94,10 R8.2 | Q6.1 67.05,32.19 | Q1.1 63.05,32.19 | IC6.10 9.62,69.38 10.24,68.76 C10.1 13.24,68.76 v14,68 | IC5.10 20.62,69.38 | 20.62,69.38 21.24,68.76 C3.1 24.24,68.76 v25,68 | IC5.12 19.32,69.33 | 19.32,69.33 18.02,68.03 IC5.3 | LED2.2 v112,26 | 20.62,69.38 19.38,69.38 19.32,69.33
  Top 0.406: 58.7,5.35 C5.1 C26.1 | VR2.5 58,8.05 v58,7 | 57.05,8.05 v57,8 v57,7 | v57,7 v57,6 | v57,6 v57,5 v58,5 v58,6 | v57,6 v58,6 | v58,6 58.7,6 | v58,6 v58,7 | v58,7 v57,7 | v58,7 58.7,7
  Top 0.508: VR2.5 58.7,7 58.7,6 58.7,5.35 | 58,8.05 57.05,8.05 55.95,8.05 50.25,13.75 C8.+ | C5.1 v58,5 | IC5.3 IC5.2 IC5.1
  pour Route2: 0.08,0.08 119.92,0.08 119.92,88.92 0.08,88.92
5V  (via drill 0.5)
  Top 0.254: U2.8 78,59 | U3.8 86,59 | 86,59 87,60 | 87,60 88.24,60 C12.1 v89,57 | 87,60 U3.1 | R9.2 85.76,59.24 86,59 | U1.1 101,61 101.24,60.76 C1.1 | R5.2 R3.2
  Top 0.305: R16.2 v79,21 | v81,57 C11.1 80.24,60 79,60 78,59 77.76,59.24 R7.2 72.76,59.24 v72,60 | IC4.12 28.32,69.33 27.02,68.03 IC4.3 | C1.1 v103,62 | v98,64 97,63 R1.2 | R2.2 95.24,57.24 94,56 v94,55 | R5.2 64.76,37.24 65.5,36.5 65.5,35.5 65,35 44,35
  Top 0.406: 60.5,12 60,12.5 C6.+ 59.75,13.5
  Top 0.508: VR2.1 63.05,8.05 63.5,8.5 63.5,9.5 63.05,9.95 VR2.3 61.3,11.2 60.5,12 | IC4.3 IC4.2 IC4.1 | D1.C 34.85,54.15 31,58
  Top 0.813: C20.1 C22.1 C21.1 C4.1 68,11.1 v68,13 68,15 68.8,15 L1.2 65.2,15.2 63.75,13.75 C6.+ 55.25,13.75 51,18 44,18 42,20 42,24 44,26 44,35 44,54 40,58 31,58 30.52,58 K1.1
  Top 1.27: IC4.2 26.38,60.09 28.49,57.97 K1.1
  Route2 0.305: v81,57 82,58 88,58 v89,57 92,57 v94,55 94,60 v98,64
  Route15 0.305: v103,62 100,62 v98,64
  Bottom 0.305: v79,21 79,16 76,13 v68,13 | v72,60 69.97,57.97 K1.1
DAC0  (via drill 0.5)
  Top 0.254: U1.6 99,57 v97,55
  Bottom 0.254: v97,55 97,76.81 J5.1
DAC1  (via drill 0.5)
  Top 0.254: U1.7 99.5,54.5 v99,54
  Bottom 0.254: v99,54 98,53 96,53 95,54 95,77.35 J5.2
DAC2  (via drill 0.5)
  Top 0.254: U1.8 100,55 v101,54
  Bottom 0.254: v101,54 101,78.27 J5.3
DAC3  (via drill 0.5)
  Top 0.254: U1.9 100.5,56.5 101,56 v102,56
  Bottom 0.254: v102,56 102,73.8 102.8,74.6 102.8,79.93 J5.4
DUT_3V3
  Top 0.406: IC5.16 IC5.15 IC5.14
  Top 1.27: IC5.15 17.38,74.38 18,75 21,75 23,77 23,83 22,84 18,84 17.27,83.27 J6.6
DUT_5V
  Top 0.406: IC4.16 IC4.15 IC4.14
  Top 1.27: IC4.15 26.38,83.62 23,87 17,87 14.73,84.73 J6.4
DUT_VIN
  Bottom 1.27: J6.2 7.27,81.27 3,77 3,68 13.03,57.97 K1.S 18.3,53.7 23,49 102,49 110.09,57.09 J7.3
GND  (via drill 0.5)
  Top 0.406: v62,5 v62,4 v63,4 v63,5 | v62,5 v63,5 | v63,5 v63,6 v62,6 v62,5
  Top 0.508: v62,5 C5.2 | VR2.2 60,9 60,7 60.9,6.1 | v62,4 61,4 60.9,4.1 C5.2 | 60.9,6.1 C5.2 | v62,6 61,6 60.9,6.1
  Top 0.813: 97.09,20.91 J9.2 101.91,20.91 | C14.2 C13.2 C2.2
  Top 2.54: 57.9,22 63,22 | 87.75,22.25 85,22.25 | 49.75,22.25 45.25,22.25
  other vias: 50,20 46,20 84,20 88,20 62,20 58,20 110,86 58,23.5 50,23.5 46,23.5 62,23.5 84,23.5 88,23.5 76,16 76,18 74,18 74,16 71,86 10,86 49,86 79,51.5 39,28.5 39,38.5 63,51.5
  pour Top: 0.08,0.08 119.92,0.08 119.92,88.92 0.08,88.92
  pour Bottom: 0.08,0.08 119.92,0.08 119.92,88.92 0.08,88.92
  pour Route15: 0.08,0.08 119.92,0.08 119.92,88.92 0.08,88.92
GP0_TX0
  Route15 0.305: J2.1 32.92,75.08 36,72 36,45 51,30 52,30 52.87,29.13 U4.1
GP1_RX0
  Route15 0.305: J2.2 34.2,79.99 34.2,74.8 37,72 37,45 51,31 54,31 55.41,29.59 U4.2
GP2
  Route15 0.305: J2.3 35.46,74.54 38,72 38,45 51,32 57,32 60.49,28.51 U4.4
GP3
  Route15 0.305: J2.4 36.7,80.03 36.7,74.3 39,72 39,45 51,33 58,33 63.03,27.97 U4.5
GP4_SDA  (via drill 0.5)
  Top 0.254: 64.95,32.19 R6.1 | IC6.8 10.38,65 | 21.38,65 IC5.8 | v32,65 30.38,65 IC4.8
  Top 0.305: Q1.2 64.95,32.19 | R6.1 64.76,30.24 65.57,29.43 U4.6 | 10.38,65 v12,65 | v23,65 21.38,65 | IC5.5 19.32,63.67 20,63 21,63 21.27,63.27 IC5.8
  Route2 0.254: v12,65 v23,65 v32,65
  Route2 0.305: U4.6 65.57,28.43 64,30 64,36 61,39 49,39 43,45 43,61 39,65 v32,65
  Route15 0.254: J6.8 21.73,81.27 27,76 27,67 25,65 v23,65
GP5_SCL  (via drill 0.5)
  Top 0.254: 68.95,32.19 R4.1 | IC6.9 10.38,71 v12,71 | v23,71 21.38,71 IC5.9 | v32,71 30.38,71 IC4.9
  Top 0.305: Q6.2 68.95,32.19 | R4.1 68.76,30.76 68.11,30.11 U4.7
  Route2 0.254: v12,71 v23,71 | v23,71 v32,71 | J6.7 23,75.54 v23,71
  Route2 0.305: U4.7 68.11,36.89 64,41 50,41 46,45 46,63 38,71 v32,71
GP6
  Route15 0.305: J2.5 38,74 40,72 40,45 51,34 72,34 73.19,32.81 U4.9
GP7
  Route15 0.305: J2.6 39.3,79.97 39.3,73.7 41,72 41,45 51,35 73,35 75.73,32.27 U4.10
GP8
  Route15 0.305: J2.7 40.54,73.46 42,72 42,45 51,36 74,36 78.27,31.73 U4.11
GP9
  Route15 0.305: J2.8 41.8,80.01 41.8,73.2 43,72 43,45 51,37 75,37 80.81,31.19 U4.12
GP10
  Route15 0.305: U4.14 85.89,31.11 79,38 51,38 44,45 44,62.81 54.92,73.73 J3.1
GP11
  Route15 0.305: U4.15 88.43,30.57 80,39 51,39 45,45 45,63 56.2,74.2 56.2,79.99 J3.2
GP12
  Route15 0.305: U4.16 90.97,30.03 81,40 51,40 46,45 46,63 57.46,74.46 J3.3
GP13
  Route15 0.305: U4.17 93.51,29.49 82,41 51,41 47,45 47,63 58.7,74.7 58.7,80.03 J3.4
GP14
  Route15 0.305: J3.5 60,75 48,63 48,45 51,42 86,42 98.59,29.41 U4.19
GP15
  Route15 0.305: U4.20 101.13,28.87 87,43 51,43 49,45 49,63 61.3,75.3 61.3,79.97 J3.6
GP17_LED
  Top 0.305: U4.22 98.59,42.41 100,41 103,41 104,40 104,29 105.4,27.6 LED2.4
GP22_PIEZO
  Top 0.305: SPKR2.1 80.81,39.53 U4.29
GP26
  Top 0.305: U4.31 75.73,47.27 62.54,60.46 J3.7
GP27
  Route15 0.305: U4.32 73.19,49.81 69,54 69,82 67,84 65,84 62.54,81.54 J3.8
GP28_DUT_VIN
  Top 0.305: R30.1 65.24,52.76 68.11,49.89 U4.34
N$1
  Top 0.254: U2.2 78.5,61.5 77.76,60.76 R7.1
N$2  (via drill 0.5)
  Top 0.254: 77.5,63.5 U2.4
  Top 0.305: R10.1 v77,69 R17.2 | 77.5,63.5 v77,64
  Bottom 0.254: v77,64 v77,69
N$3
  Top 0.305: C9.1 69,21.76 L1.1
  Top 0.813: VR1.8 71.92,18.8 L1.1
N$4  (via drill 0.5)
  Top 0.305: R12.1 v75,69 R18.2 | U2.5 75.89,62.11 75,63 v75,64
  Bottom 0.254: v75,64 v75,69
N$5  (via drill 0.5)
  Top 0.254: U2.6 76,57.89 75.11,57 v75,57
  Top 0.305: R13.1 v79,69 R19.2
  Bottom 0.254: v79,69 79,61 v75,57
N$6  (via drill 0.5)
  Top 0.254: v77,56 77.5,56.5 U2.7
  Top 0.305: R14.1 v81,69 R20.2
  Bottom 0.254: v81,69 81,60 v77,56
N$7  (via drill 0.5)
  Top 0.305: R28.1 v83,69 R21.2 | v85,64 85.5,63.5 U3.4
  Bottom 0.254: v83,69 83,66 v85,64
N$8
  Top 1.27: D2.2 26.5,40 18,40 8,50 8,53 6.9,54.1 F3.2 F3.1
N$9  (via drill 0.5)
  Top 0.254: U3.5 84.89,62 v84,62
  Top 0.305: R27.1 v85,69 R22.2
  Bottom 0.254: v84,62 85,62 86,63 86,65 85,66 v85,69
N$10  (via drill 0.5)
  Top 0.254: U3.6 85,57 v84,56
  Top 0.305: R26.1 v87,69 R23.2
  Bottom 0.254: v84,56 87,59 v87,69
N$11  (via drill 0.5)
  Top 0.254: U3.7 85.5,56.5 v86,56
  Top 0.305: R25.1 v89,69 R24.2
  Bottom 0.254: v86,56 89,59 v89,69
N$12
  Top 0.254: U3.2 86.5,61.5 85.76,60.76 R9.1
N$13
  Top 0.305: R15.2 76.91,12.33 VR1.4
N$14
  Top 0.305: J8.1 111.5,32.5 116,37 116,61.72 J7.1
N$15
  Top 0.305: J8.3 108,57.9 111,60.9 J7.2
N$16  (via drill 0.5)
  Top 0.305: IC6.16 IC6.15 IC6.14
  Top 1.27: v6,74 6.38,73.62 IC6.15
  Bottom 1.27: K1.P 28,52 24,56 24,59 18,65 18,72 16,74 v6,74
N$17  (via drill 0.5)
  Top 0.254: Q2.3 51,50.1 v51,47
  Top 0.508: D1.A 34.85,49.85 31,46 30.52,46 K1.2
  Bottom 0.254: v51,47 50.03,46.03 K1.2
N$18
  Top 0.305: R11.2 R16.1 78.64,18.24 VR1.5
N$19
  Top 0.305: C9.2 74,22 74.36,21.64 VR1.7
N$20
  pour Top: 56.5,4.5 58.5,4.5 58.5,8.5 56.5,8.5
N$21
  Top 0.254: R2.1 99.5,61.26 U1.4
N$22
  Top 0.254: R1.1 97.24,61 98,61 99,62 U1.5
N$23
  Top 0.305: LED1.A R8.1
N$24
  Top 0.254: Q2.1 56.81,51.05 R29.2 R30.2
N$25
  Bottom 1.27: F3.3 F3.4 4,25 8,21 S1.6 S1.1
N$26
  Top 1.27: D2.3 D2.1 14.06,36.54 J1.+
SCL_5V  (via drill 0.5)
  Top 0.254: Q6.3 68.76,36.86 R3.1 | U2.10 79,57 v81,55 | U3.10 87,57 v89,55 90,55 92,57 92,61 97,66 100,66 100.5,65.5 U1.2
  Top 0.305: R3.1 75,38 79.5,42.5 79.5,46.5 81,48 v81,55
  Route15 0.254: v81,55 v89,55
SDA_5V  (via drill 0.5)
  Top 0.254: Q1.3 63.24,36.86 R5.1 | U2.9 78.5,56.5 79,56 v79,54 | v87,54 87,56.35 86.5,56.85 U3.9 | v99,65 100,64 U1.3
  Top 0.305: R5.1 63.24,39.74 64.5,41 74.5,41 77,43.5 77,51 77,51.5 77,52 v79,54
  Route15 0.254: v79,54 v87,54 91,54 93,56 93,61 97,65 v99,65
VIN+  (via drill 0.5)
  Top 0.305: IC6.12 8.32,69.33 7.03,68.03 IC6.3
  Top 0.508: IC6.3 IC6.2 IC6.1
  Top 0.813: VR1.2 75,14.03 | 75,14.03 VR1.3 | C7.+ 96.16,13.75 J9.1 | 75,14.03 C14.1 C13.1 C2.1 83.4,7.4 v86,10
  Top 1.27: IC6.2 6.38,60.62 15,52 19,52 29,42 39,42 41,40 41,27 39,25 20,25 19.01,24.01 S1.5 | v86,10 C7.+
  Bottom 1.27: S1.5 S1.2 19.01,13.99 23,10 v86,10
VSENSE0
  Top 0.305: R10.2 76.92,71.84 J4.1
VSENSE1
  Top 0.305: R12.2 75,79.35 J4.2
VSENSE2
  Top 0.305: R13.2 79,78.27 J4.3
VSENSE3
  Top 0.254: 80.7,80.03 J4.4
  Top 0.305: R14.2 81,74.96 80.7,75.26 80.7,80.03
VSENSE4
  Top 0.305: R28.2 83,75 82,76 J4.5
VSENSE5
  Top 0.254: 83.3,79.97 J4.6
  Top 0.305: R27.2 85,75 83.3,76.7 83.3,79.97
VSENSE6
  Top 0.305: R26.2 87,75 84.54,77.46 J4.7
VSENSE7
  Top 0.305: R25.2 89,76.2 89.6,76.8 89.6,81.2 87.6,83.2 86.47,83.2 J4.8

### Text on the board
tPlace: Power | Digital 0-7 | Digital 8-15 | Analog 0-7 | DAC 0-7 | Testomatic | by Jon Oxer | 10A FUSE | SKU: TESTOMATIC | v1.0
bPlace: (C)2024 SuperHouse Automation Pty Ltd | www.superhouse.tv/testomator | Made in / Australia